# EAGLE design rev2 (EAGLE 9.3.0)
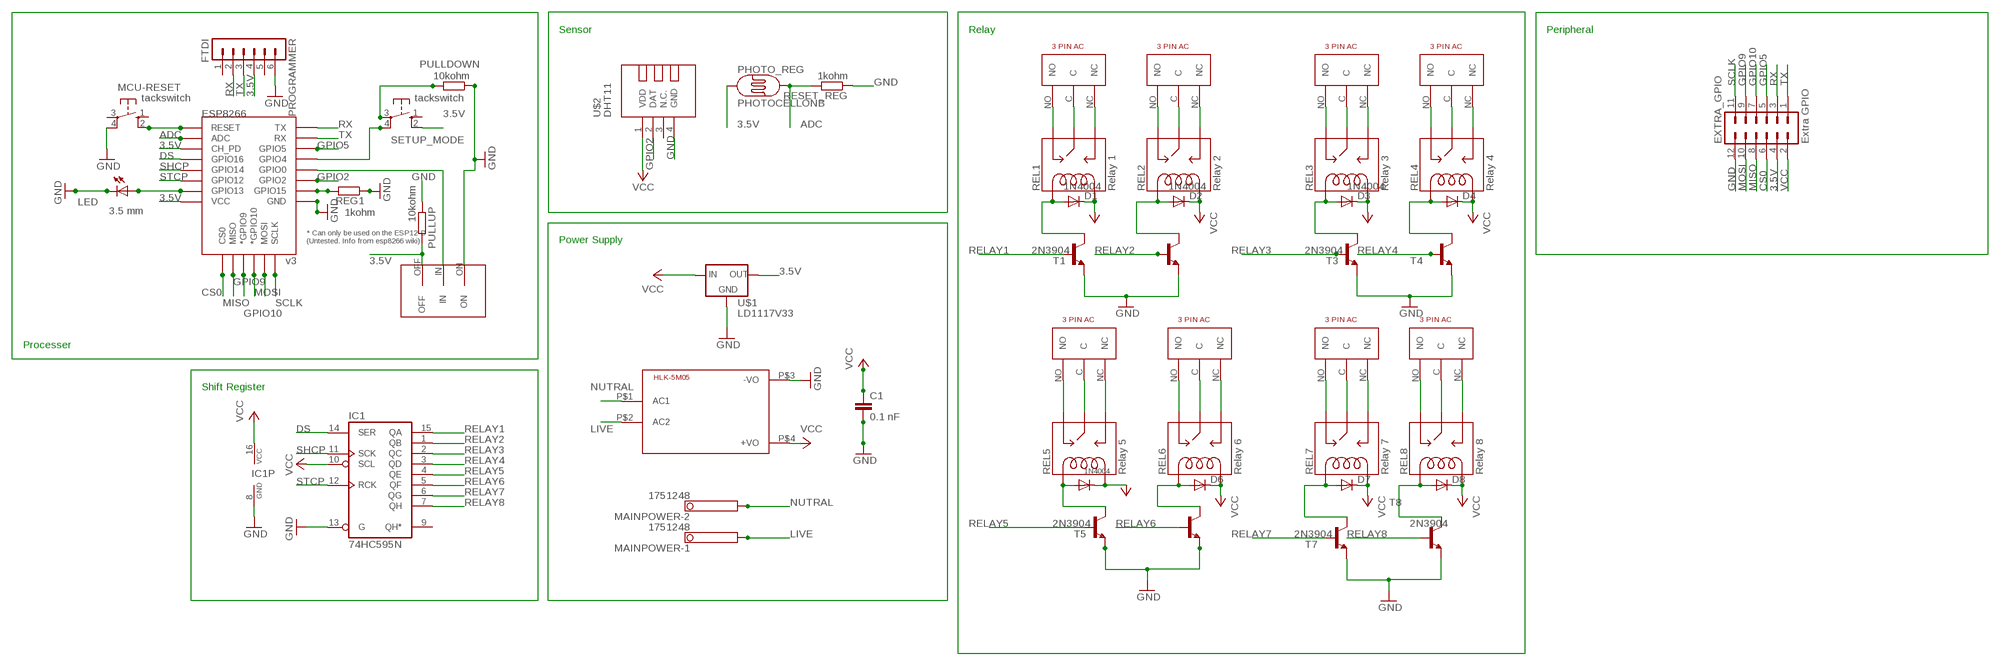
[diagram p0: schematic, sheet 1]

## Parts
C1  0.1 nF  0.1UF-KIT-EZ-50V-20%  [CAP-PTH-SMALL-KIT]
CON-REL-1  3PINAC  [LIB]
CON-REL-2  3PINAC  [LIB]
CON-REL-3  3PINAC  [LIB]
CON-REL-4  3PINAC  [LIB]
CON-REL-5  3PINAC  [LIB]
CON-REL-6  3PINAC  [LIB]
CON-REL-7  3PINAC  [LIB]
CON-REL-8  3PINAC  [LIB]
D1  1N4004  [DO41-10]
D2  1N4004  [DO41-10]
D3  1N4004  [DO41-10]
D4  1N4004  [DO41-10]
D5  1N4004  [DO41-10]
D6  1N4004  [DO41-10]
D7  1N4004  [DO41-10]
D8  1N4004  [DO41-10]
ESP8266  v3  ESP12ESMD  [ESP12E-SMD]
EXTRA_GPIO  Extra GPIO  MA06-2  [MA06-2]
FLASH  TOGGLE_SWITCH  [TOGGLE_SWITCH]
HLK-5M05  AC to DC Converter  HKLPM01  [HKLPM01]
IC1  74HC595N  [DIL16]
LED  3.5 mm  LED3MM  [LED3MM]
MAINPOWER  1751248  [1751248]
MCU-RESET  tackswitch  10-XX  [B3F-10XX]
PHOTO_REG  PHOTOCELLONB  [ON_BOARD]
PROGRAMMER  FTDI  MA06-1  [MA06-1]
PULLDOWN  10kohm  R-EU_0204/7  [0204/7]
PULLUP  10kohm  R-EU_0204/7  [0204/7]
REG1  1kohm  R-EU_0204/7  [0204/7]
REL1  Relay 1  RELAYPTH  [SRD-05VDC-SL-C]
REL2  Relay 2  RELAYPTH  [SRD-05VDC-SL-C]
REL3  Relay 3  RELAYPTH  [SRD-05VDC-SL-C]
REL4  Relay 4  RELAYPTH  [SRD-05VDC-SL-C]
REL5  Relay 5  RELAYPTH  [SRD-05VDC-SL-C]
REL6  Relay 6  RELAYPTH  [SRD-05VDC-SL-C]
REL7  Relay 7  RELAYPTH  [SRD-05VDC-SL-C]
REL8  Relay 8  RELAYPTH  [SRD-05VDC-SL-C]
RESET_REG  1kohm  R-EU_0204/7  [0204/7]
SETUP_MODE  tackswitch  10-XX  [B3F-10XX]
T1  2N3904  BC618  [TO92-EBC]
T2  2N3904  BC618  [TO92-EBC]
T3  2N3904  BC618  [TO92-EBC]
T4  2N3904  BC618  [TO92-EBC]
T5  2N3904  BC618  [TO92-EBC]
T6  2N3904  BC618  [TO92-EBC]
T7  2N3904  BC618  [TO92-EBC]
T8  2N3904  BC618  [TO92-EBC]
U$1  LD1117V33  [LD1117V33]
U$2  DHT11  TEMP-HUM-SENSOR-DHT11  [TEMP-HUM-SENSOR-DHT11]

## Nets
3.5V: ESP8266.CH_PD ESP8266.VCC EXTRA_GPIO.4 FLASH.OFF PHOTO_REG.1 PROGRAMMER.4 PULLUP.2 SETUP_MODE.2(S1) U$1.OUT
ADC: ESP8266.ADC PHOTO_REG.2 RESET_REG.2
CS0: ESP8266.CS0 EXTRA_GPIO.6
DS: ESP8266.GPIO16 IC1.14(SER)
GND: C1.2 ESP8266.GND EXTRA_GPIO.12 FLASH.ON HLK-5M05.P$3(-VO) IC1.8(GND) IC1.13(G) LED.K(C) MCU-RESET.4(P1) PROGRAMMER.6 PULLDOWN.1 PULLUP.1 REG1.1 RESET_REG.1 T1.E T2.E T3.E T4.E T5.E T6.E T7.E T8.E U$1.GND U$2.4(GND)
GPIO2: ESP8266.GPIO2 U$2.2(DAT)
GPIO5: ESP8266.GPIO5 EXTRA_GPIO.5
GPIO9: ESP8266.GPIO9(*GPIO9) EXTRA_GPIO.9
GPIO10: ESP8266.GPIO10(*GPIO10) EXTRA_GPIO.7
LIVE: HLK-5M05.P$2(AC2) MAINPOWER.1
MISO: ESP8266.MISO EXTRA_GPIO.8
MOSI: ESP8266.MOSI EXTRA_GPIO.10
N$1: D5.A REL5.COIL1 T5.C
N$2: D6.A REL6.COIL1 T6.C
N$3: D7.A REL7.COIL1 T7.C
N$4: D8.A REL8.COIL1 T8.C
N$5: D4.A REL4.COIL1 T4.C
N$6: D3.A REL3.COIL1 T3.C
N$7: ESP8266.GPIO13 LED.A
N$8: D2.A REL2.COIL1 T2.C
N$9: D1.A REL1.COIL1 T1.C
N$10: CON-REL-5.NC REL5.SWOPEN
N$11: CON-REL-5.C REL5.SWCOMMON
N$12: CON-REL-5.NO REL5.SWCLOSED(SWCLOSE)
N$13: CON-REL-6.NC REL6.SWOPEN
N$14: CON-REL-6.C REL6.SWCOMMON
N$15: CON-REL-6.NO REL6.SWCLOSED(SWCLOSE)
N$16: CON-REL-7.NC REL7.SWOPEN
N$17: CON-REL-7.C REL7.SWCOMMON
N$18: CON-REL-7.NO REL7.SWCLOSED(SWCLOSE)
N$19: CON-REL-8.NC REL8.SWOPEN
N$20: CON-REL-8.C REL8.SWCOMMON
N$21: CON-REL-8.NO REL8.SWCLOSED(SWCLOSE)
N$22: CON-REL-4.NC REL4.SWOPEN
N$23: CON-REL-4.C REL4.SWCOMMON
N$24: CON-REL-4.NO REL4.SWCLOSED(SWCLOSE)
N$25: CON-REL-3.NC REL3.SWOPEN
N$26: ESP8266.GPIO4 SETUP_MODE.4(P1)
N$27: ESP8266.GPIO15 REG1.2
N$28: ESP8266.GPIO0 FLASH.IN
N$29: PULLDOWN.2 SETUP_MODE.3(P)
N$31: ESP8266.RESET MCU-RESET.2(S1)
N$39: CON-REL-3.C REL3.SWCOMMON
N$40: CON-REL-3.NO REL3.SWCLOSED(SWCLOSE)
N$41: CON-REL-2.NC REL2.SWOPEN
N$42: CON-REL-2.C REL2.SWCOMMON
N$43: CON-REL-2.NO REL2.SWCLOSED(SWCLOSE)
N$44: CON-REL-1.NC REL1.SWOPEN
N$45: CON-REL-1.C REL1.SWCOMMON
N$46: CON-REL-1.NO REL1.SWCLOSED(SWCLOSE)
NUTRAL: HLK-5M05.P$1(AC1) MAINPOWER.2
RELAY1: IC1.15(QA) T1.B
RELAY2: IC1.1(QB) T2.B
RELAY3: IC1.2(QC) T3.B
RELAY4: IC1.3(QD) T4.B
RELAY5: IC1.4(QE) T5.B
RELAY6: IC1.5(QF) T6.B
RELAY7: IC1.6(QG) T7.B
RELAY8: IC1.7(QH) T8.B
RX: ESP8266.TXD0(TX) EXTRA_GPIO.3 PROGRAMMER.2
SCLK: ESP8266.SCLK EXTRA_GPIO.11
SHCP: ESP8266.GPIO14 IC1.11(SCK)
STCP: ESP8266.GPIO12 IC1.12(RCK)
TX: ESP8266.RXD0(RX) EXTRA_GPIO.1 PROGRAMMER.3
VCC: C1.1 D1.C D2.C D3.C D4.C D5.C D6.C D7.C D8.C EXTRA_GPIO.2 HLK-5M05.P$4(+VO) IC1.10(SCL) IC1.16(VCC) REL1.COIL0 REL2.COIL0 REL3.COIL0 REL4.COIL0 REL5.COIL0 REL6.COIL0 REL7.COIL0 REL8.COIL0 U$1.IN U$2.1(VDD)
Unconnected: IC1.9(QH*) MCU-RESET.1(S) MCU-RESET.3(P) PROGRAMMER.1 PROGRAMMER.5 SETUP_MODE.1(S) U$2.3(N.C.)

## Notes on the sheet
- Sensor | Relay | Peripheral
- Power Supply
- Processer
- Shift Register

## Library data of the parts
C1 = SparkFun-Capacitors:0.1UF: 0.1µF ceramic capacitors A capacitor is a passive two-terminal electrical component used to store electrical energy temporarily in an electric field.; PROD_ID: CAP-08370; VALUE: 0.1uF
CON-REL-1-CON-REL-8 = 3 PIN AC Connector:3PINAC
D1-D8 = adafruit:1N4004: DIODE General purpose 1N400x type rectifier (With bigger pads) http://www.ladyada.net/library/pcb/eaglelibrary.html
ESP8266 = esp8266modules:ESP12E: ESP12E Module
EXTRA_GPIO = con-lstb:MA06-2: PIN HEADER; OC_FARNELL: unknown; OC_NEWARK: unknown
FLASH = Toggle Switch:TOGGLE_SWITCH
HLK-5M05 = HLKPM01EaglesLib:HKLPM01
IC1 = 74xx:74*595: 8-bit SHIFT REGISTER, output latch
LED = led:LED: LED OSRAM: - CHIPLED LG R971, LG N971, LY N971, LG Q971, LY Q971, LO R971, LY R971 LH N974, LH R974 LS Q976, LO Q976, LY Q976 LO Q996 - Hyper CHIPLED LW Q18S LB Q993, LB Q99A, LB R99A - SideLED LS A670, LO A670, LY A670, LG A670, LP A670 LB A673, LV A673, LT A673, LW A673 LH A674 LY A675 LS A676, LA A676, LO A676, LY A676, LW A676 LS A679, LY A679, LG A679 - Hyper Micro SIDELED® LS Y876, LA Y876, LO Y876, LY Y876 LT Y87S - SmartLED LW L88C, LW L88S LB L89C, LB L89S, LG L890 LS L89K, LO L89K, LY L89K LS L896, LA L896, LO L896, LY L896 - TOPLED LS T670, LO T670, LY T670, LG T670, LP T670 LSG T670, LSP T670, LSY T670, LOP T670, LYG T670 LG T671, LOG T671, LSG T671 LB T673, LV T673, LT T673, LW T673 LH T674 LS T676, LA T676, LO T676, LY T676, LB T676, LH T676, LSB T676, LW T676 LB T67C, LV T67C, LT T67C, LS T67K, LO T67K, LY T67K, LW E67C LS E67B, LA E67B, LO E67B, LY E67B, LB E67C, LV E67C, LT E67C LW T67C LS T679, LY T679, LG T679 LS T770, LO T770, LY T770, LG T770, LP T770 LB T773, LV T773, LT T773, LW T773 LH T774 LS E675, LA E675, LY E675, LS T675 LS T776, LA T776, LO T776, LY T776, LB T776 LHGB T686 LT T68C, LB T68C - Hyper Mini TOPLED® LB M676 - Mini TOPLED Santana® LG M470 LS M47K, LO M47K, LY M47K Source: http://www.osram.convergy.de LUXEON: - LUMILED® LXK2-PW12-R00, LXK2-PW12-S00, LXK2-PW14-U00, LXK2-PW14-V00 LXK2-PM12-R00, LXK2-PM12-S00, LXK2-PM14-U00 LXK2-PE12-Q00, LXK2-PE12-R00, LXK2-PE12-S00, LXK2-PE14-T00, LXK2-PE14-U00 LXK2-PB12-K00, LXK2-PB12-L00, LXK2-PB12-M00, LXK2-PB14-N00, LXK2-PB14-P00, LXK2-PB14-Q00 LXK2-PR12-L00, LXK2-PR12-M00, LXK2-PR14-Q00, LXK2-PR14-R00 LXK2-PD12-Q00, LXK2-PD12-R00, LXK2-PD12-S00 LXK2-PH12-R00, LXK2-PH12-S00 LXK2-PL12-P00, LXK2-PL12-Q00, LXK2-PL12-R00 Source: www.luxeon.com KINGBRIGHT: KA-3528ASYC Source: www.kingbright.com
MAINPOWER = con-phoenix-350:1751248: MKDS 1/ 2-3,5 Printklemme Nennstrom: 10 A Bemessungsspannung: 160 V Raster: 3,5 mm Polzahl: 2 Montageart: Löten Anschlussart: Schraubanschluss Anschlussrichtung vom Leiter zur Platine: 0° Source: http://eshop.phoenixcontact.com .. 1751248.pdf; OC_FARNELL: unknown; OC_NEWARK: unknown
MCU-RESET SETUP_MODE = buttons:10-XX: OMRON SWITCH
PHOTO_REG = LDR:PHOTOCELL: Photo Resitor
PROGRAMMER = con-lstb:MA06-1: PIN HEADER; OC_FARNELL: unknown; OC_NEWARK: unknown
PULLDOWN PULLUP REG1 RESET_REG = resistor:R-EU_: RESISTOR, European symbol
REL1-REL8 = SRD-05VDC-SL-C:RELAY: SPDT relay (COM-00101)
T1-T8 = transistor-npn:BC618*: NPN Transistor
U$1 = LD1117V33:LD1117V33
U$2 = diy-modules:TEMP-HUM-SENSOR-DHT11: DHT11 - digital humidity & temperature sensor DHT11 datasheet available here: https://akizukidenshi.com/download/ds/aosong/DHT11.pdf Click here to find device on ebay.com <http://www.ebay.com/sch/dht11+digital+sensor>

## Net classes
0 default: width 0.2 mm, clearance 0.205 mm

## Board
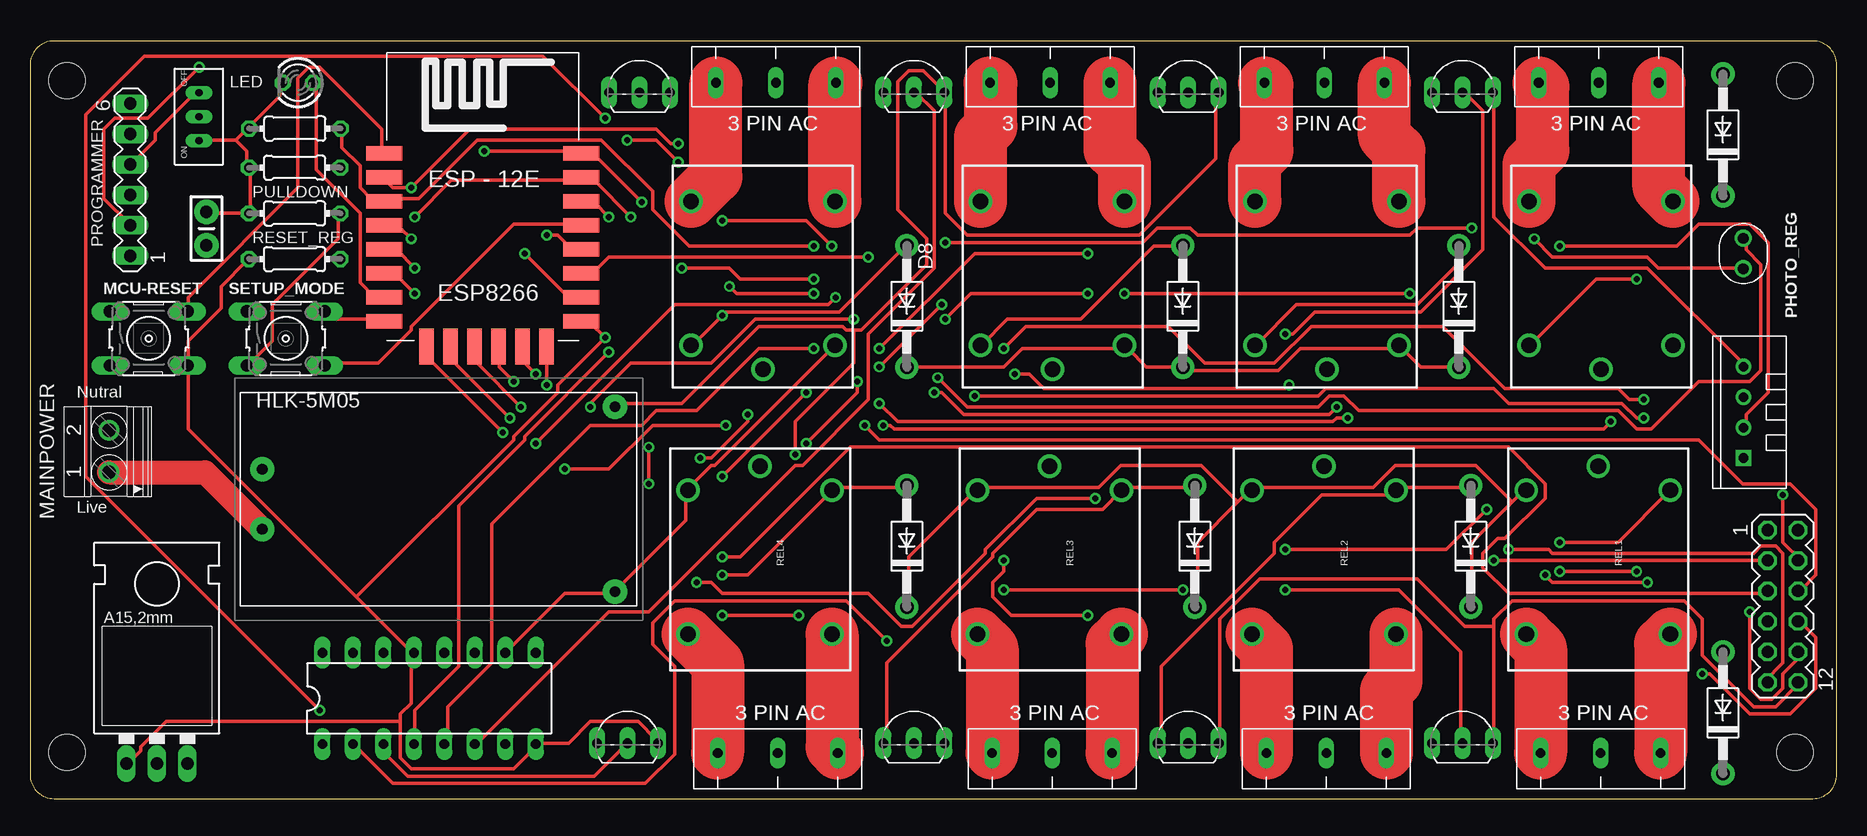
[diagram p1: board, top side]
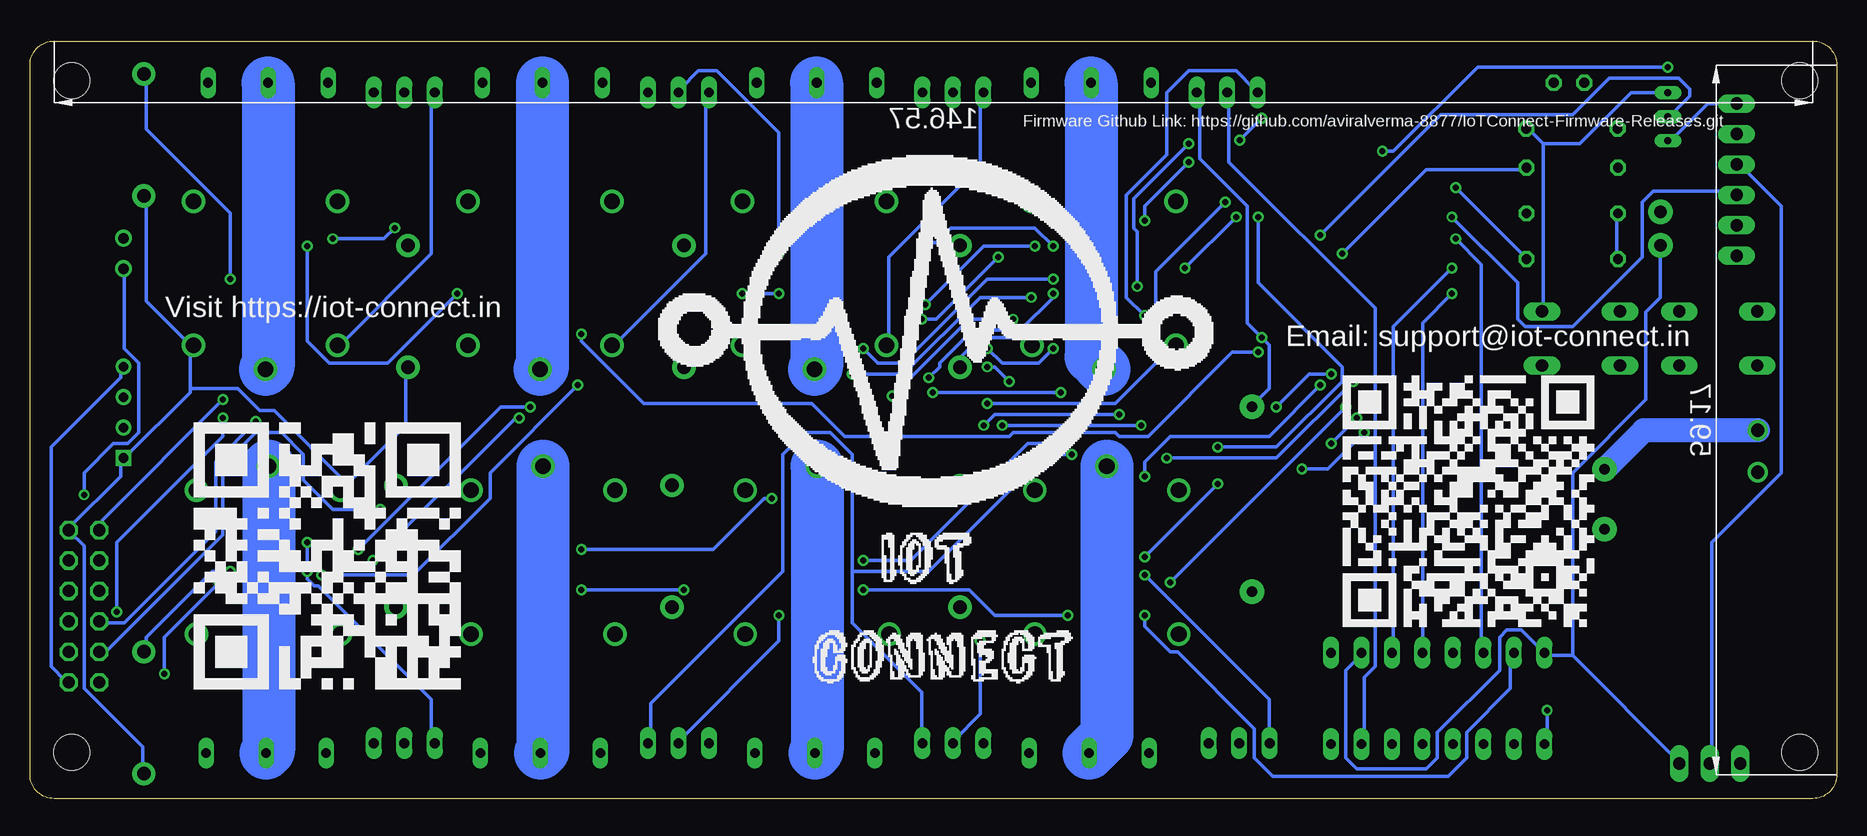
[diagram p2: board, bottom side, seen from below]

Size 150.57 x 63.17 mm. Coordinates in mm from the lower left corner, seen from the top.
Outline: 0,61.17 0,2 arc90 2,0 148.57,0 arc90 150.57,2 150.57,61.17 arc90 148.57,63.17 2,63.17 arc90 0,61.17
Copper layers (1*16): Top 0.035mm / dielectric 1.5mm / Bottom 0.035mm
Design rules "default *": minimum track width 12mil, minimum drill 0.5mm, track to track 12mil, track to pad 12mil, pad to pad 12mil, via to via 12mil, smd to smd 12mil, copper to edge 40mil, drill to drill 12mil, minimum pad ring 10mil, minimum via ring 8mil, stop-mask expansion 4mil, vias tented up to drill 0mil, thermal gap 10mil
Holes 3 mm at 3.08,59.87 147.08,59.87 147.08,3.87 3.08,3.87

### Footprints (pad centres in the part's own frame; a part is rotated, then mirrored left to right if it is on the bottom)
CAP-PTH-SMALL-KIT = drill 1.016 pad 2.032: 1 -1.397,0; 2 1.397,0
LIB = drill 0.8 long: C 5,0; NC 0,0; NO 10,0
DO41-10 = drill 1.118 pad 1.93: A 5.08,0; C -5.08,0
ESP12E-SMD = smd 3 x 1.2: ADC -8.3,3.8; CH_PD -8.3,1.8; GND 8.1,-8.2; GPIO0 8.1,-2.2; GPIO2 8.1,-4.2; GPIO4 8.1,-0.2; GPIO5 8.1,1.8; GPIO12 -8.3,-4.2; GPIO13 -8.3,-6.2; GPIO14 -8.3,-2.2; GPIO15 8.1,-6.2; GPIO16 -8.3,-0.2; RESET -8.3,5.8; RXD0 8.1,3.8; TXD0 8.1,5.8; VCC -8.3,-8.2 | smd 1.2 x 3: CS0 -4.8,-10.3; GPIO9 -0.8,-10.3; GPIO10 1.2,-10.3; MISO -2.8,-10.3; MOSI 3.2,-10.3; SCLK 5.2,-10.3
MA06-2 = drill 1.016 octagon: 1 -6.35,-1.27; 2 -6.35,1.27; 3 -3.81,-1.27; 4 -3.81,1.27; 5 -1.27,-1.27; 6 -1.27,1.27; 7 1.27,-1.27; 8 1.27,1.27; 9 3.81,-1.27; 10 3.81,1.27; 11 6.35,-1.27; 12 6.35,1.27
TOGGLE_SWITCH = drill 0.6 long: IN 2,0; OFF 4,0; ON 0,0
HKLPM01 = drill 0.889 pad 2.032: P$1 -14.7,2.5; P$2 -14.7,-2.5; P$3 14.7,7.7; P$4 14.7,-7.7
DIL16 = drill 0.813 long: 1 -8.89,-3.81; 2 -6.35,-3.81; 3 -3.81,-3.81; 4 -1.27,-3.81; 5 1.27,-3.81; 6 3.81,-3.81; 7 6.35,-3.81; 8 8.89,-3.81; 9 8.89,3.81; 10 6.35,3.81; 11 3.81,3.81; 12 1.27,3.81; 13 -1.27,3.81; 14 -3.81,3.81; 15 -6.35,3.81; 16 -8.89,3.81
LED3MM = drill 0.813 octagon: A -1.27,0; K 1.27,0
1751248 = drill 1.1 pad 1.7: 1 -1.75,-0.1; 2 1.75,-0.1
B3F-10XX = drill 1.016 long: 1 -3.251,2.261; 2 3.251,2.261; 3 -3.251,-2.261; 4 3.251,-2.261
ON_BOARD = drill 0.9: 1 -1.27,0; 2 1.27,0
MA06-1 = drill 1.016 long: 1 -6.35,0; 2 -3.81,0; 3 -1.27,0; 4 1.27,0; 5 3.81,0; 6 6.35,0
0204/7 = drill 0.813 octagon: 1 -3.81,0; 2 3.81,0
SRD-05VDC-SL-C = drill 1.3: COIL0 -5.39,-6.12; COIL1 -5.39,5.88; SWCLOSED 6.61,-6.12; SWCOMMON -7.39,-0.12; SWOPEN 6.61,5.88
TO92-EBC = drill 0.813 long: B 0,-1.27; C -2.54,-1.27; E 2.54,-1.27
LD1117V33 = drill 1.016 long: GND -2.54,-8.89; IN 2.54,-8.89; OUT 0,-8.89
TEMP-HUM-SENSOR-DHT11 = drill 0.8 square: 1 -3.81,0 | drill 0.8: 2 -1.27,0; 3 1.27,0; 4 3.81,0

### Placement (x,y rotation side)
C1  14.7,47.53 90 top
CON-REL-1  135.89,3.81 180 top
CON-REL-2  113.03,3.81 180 top
CON-REL-3  90.17,3.81 180 top
CON-REL-4  67.31,3.81 180 top
CON-REL-5  125.73,59.69 0 top
CON-REL-6  102.87,59.69 0 top
CON-REL-7  80.01,59.69 0 top
CON-REL-8  57.15,59.69 0 top
D1  141.08,7.16 90 top
D2  120.07,21.04 90 top
D3  97.07,21.04 90 top
D4  73.07,21.04 90 top
D5  141.08,55.34 90 top
D6  119.07,41.04 90 top
D7  96.07,41.04 90 top
D8  73.07,41.04 90 top
ESP8266  37.83,47.99 0 top
EXTRA_GPIO  146.07,16.04 270 top
FLASH  14.08,54.87 90 top
HLK-5M05  34.05,24.96 0 top
IC1  33.26,8.35 0 top
LED  22.32,59.69 180 top
MAINPOWER  6.49,28.96 90 top
MCU-RESET  9.89,38.37 0 top
PHOTO_REG  142.78,45.45 90 top
PROGRAMMER  8.35,51.61 90 top
PULLDOWN  22.05,48.8 0 top
PULLUP  22.08,55.87 0 top
REG1  22.05,52.61 0 top
REL1  130.81,20.32 270 top
REL2  107.95,20.32 270 top
REL3  85.09,20.32 270 top
REL4  60.96,20.32 270 top
REL5  130.81,43.18 90 top
REL6  107.95,43.18 90 top
REL7  85.09,43.18 90 top
REL8  60.96,43.18 90 top
RESET_REG  22.05,44.99 0 top
SETUP_MODE  21.32,38.37 0 top
T1  119.38,5.89 0 top
T2  96.52,5.89 0 top
T3  73.66,5.89 0 top
T4  49.8,5.89 0 top
T5  119.38,60.15 0 top
T6  96.52,60.15 0 top
T7  73.66,60.15 0 top
T8  50.8,60.15 0 top
U$1  10.58,11.81 0 top
U$2  142.78,32.21 90 top

### Tracks (layer width: path | path; a pad name or v marks a point on that pad's centre or on a via)
3.5V  (via drill 0.5)
  Top 0.305: v146.07,25.34 146.07,21.38 147.59,19.85 EXTRA_GPIO.4 | ESP8266.VCC 29.33,39.97 25.37,39.97 24.76,40.58 SETUP_MODE.2 | PULLUP.2 25.98,55.82 25.98,54.29 27.5,52.77 27.5,50.94 28.42,50.03 29.33,50.03 ESP8266.CH_PD 29.64,50.03 32.38,50.03 37.26,54.9 47.62,54.9 51.89,50.64 51.89,49.11 54.93,46.06 v65.3,46.06 | FLASH.OFF 13.79,58.87 10.43,55.51 10.43,54.9 8.6,53.07 PROGRAMMER.4 | v125.34,46.67 126.87,45.15 134.79,45.15 135.71,44.23 142.72,44.23 PHOTO_REG.1 | v120.16,47.59 115.59,47.59 114.98,46.98 97.3,46.98 96.69,47.59 93.95,47.59 92.73,46.37 v76.27,46.37
  Bottom 0.305: v146.07,25.34 146.07,27.17 143.63,29.61 142.41,29.61 141.5,30.52 141.5,36.31 142.72,37.53 142.72,43.93 PHOTO_REG.1 | 24.45,54.6 24.45,40.88 SETUP_MODE.2 | 24.45,54.6 25.67,55.82 PULLUP.2 | U$1.OUT 10.43,3.09 10.43,21.38 4.64,27.17 4.64,49.42 8.3,53.07 PROGRAMMER.4 | 24.45,54.6 21.41,54.6 17.14,58.87 14.09,58.87 FLASH.OFF | v125.34,46.67 121.08,46.67 v120.16,47.59 | v76.27,46.37 75.05,46.37 73.83,47.59 66.82,47.59 v65.3,46.06
ADC  (via drill 0.5)
  Top 0.305: ESP8266.ADC 29.64,51.55 30.25,50.94 v31.77,50.94 36.65,55.82 52.19,55.82 53.41,54.6 v54.02,54.6 | v75.66,35.09 78.1,32.65 107.36,32.65 108.27,33.57 109.49,33.57 110.71,32.35 132.35,32.35 133.88,30.82 135.1,30.82 139.06,34.79 143.33,34.79 144.24,35.7 144.24,44.54 143.02,45.76 143.02,46.67 PHOTO_REG.2 | v65.3,42.1 58.9,42.1 v58.29,42.71
  Bottom 0.305: v31.77,50.94 25.98,45.15 RESET_REG.2 | v75.66,35.09 74.75,36.01 74.75,36.31 72,39.05 68.04,39.05 65.3,41.8 v65.3,42.1 | v58.29,42.71 58.29,47.28 58.59,47.59 58.59,50.03 v54.02,54.6
CS0  (via drill 0.5)
  Top 0.305: v39.39,30.52 33.29,36.62 33.29,37.53 ESP8266.CS0 | v44.57,27.47 48.23,27.47 51.89,31.13 v57.98,31.13 | v69.56,31.13 70.78,29.91 139.06,29.91 142.72,26.25 146.68,26.25 148.81,24.12 148.81,18.63 147.59,17.41 EXTRA_GPIO.6
  Bottom 0.305: v39.39,30.52 42.44,27.47 v44.57,27.47 | v69.56,31.13 v57.98,31.13
DS  (via drill 0.5)
  Top 0.305: v31.77,46.67 30.86,47.59 29.64,47.59 ESP8266.GPIO16
  Bottom 0.305: v31.77,46.67 29.64,44.54 29.64,12.23 IC1.14
GND  (via drill 0.5)
  Top 0.305: 121.99,14.37 121.99,14.97 123.51,16.5 137.84,16.5 139.36,14.97 139.36,11.93 143.63,7.66 145.46,7.66 147.29,9.49 EXTRA_GPIO.12 | 121.99,14.37 121.99,4.92 T1.E | T5.E 121.99,58.87 121.99,48.5 126.26,44.23 134.79,44.23 142.72,36.31 U$2.4 | 121.99,14.37 119.55,14.37 115.59,18.33 102.48,18.33 99.13,14.97 99.13,4.92 T2.E | T6.E 98.82,58.87 98.82,53.38 92.42,46.98 78.1,46.98 76.27,48.81 76.27,58.87 T7.E 75.96,59.17 74.44,60.69 73.22,60.69 72.31,59.78 72.31,49.11 74.75,46.67 74.75,44.54 69.26,39.05 68.65,39.05 | ESP8266.GND 46.09,39.66 46.7,39.66 v47.92,38.44 43.96,34.48 43.96,33.87 40.3,30.21 40.3,29.91 27.2,16.8 | 68.65,39.05 68.04,39.05 67.74,39.36 60.73,39.36 54.32,32.96 48.84,32.96 HLK-5M05.P$3 | RESET_REG.1 18.05,44.84 15.92,42.71 15.92,40.88 13.18,38.14 13.18,36.31 MCU-RESET.4 13.18,36.01 13.18,30.82 27.2,16.8 | C1.2 14.7,48.81 18.05,48.81 PULLDOWN.1 18.36,48.81 18.36,52.47 REG1.1 18.05,52.77 18.05,53.99 17.14,54.9 | 17.14,54.9 14.09,54.9 FLASH.ON | 17.14,54.9 18.05,55.82 PULLUP.1 18.36,56.12 20.8,58.56 20.8,59.48 LED.K | T4.E 52.19,4.92 50.67,6.44 46.7,6.44 44.88,4.61 42.44,4.61 IC1.8 42.13,4.31 40.3,2.48 31.77,2.48 30.86,3.39 30.86,6.44 | 30.86,6.44 30.86,7.05 31.77,7.96 31.77,11.93 IC1.13 31.77,12.23 27.2,16.8 | 30.86,6.44 11.35,6.44 9.21,4.31 9.21,4 8.3,3.09 U$1.GND | v63.77,28.69 63.77,31.43 68.65,36.31 68.65,39.05
  Bottom 0.305: 82.06,18.94 82.06,28.69 83.89,30.52 86.02,30.52 87.85,28.69 87.85,18.94 98.82,7.96 98.82,4.92 T2.E | 82.06,18.94 82.06,14.67 76.27,8.88 76.27,4.92 T3.E | U$2.4 143.02,36.01 143.02,35.09 148.81,29.3 148.81,11.01 147.59,9.79 EXTRA_GPIO.12 | T8.E 53.1,58.87 53.1,53.38 49.14,49.42 49.14,39.66 v47.92,38.44 47.31,37.83 47.31,34.18 48.53,32.96 HLK-5M05.P$3 | RESET_REG.1 18.36,45.15 18.36,48.5 PULLDOWN.1 | PROGRAMMER.6 8.6,57.95 10.74,57.95 13.79,54.9 FLASH.ON | 82.06,18.94 75.66,18.94 65.91,28.69 v63.77,28.69
GPIO2  (via drill 0.5)
  Top 0.305: v127.48,46.06 137.23,46.06 139.06,47.89 143.33,47.89 144.85,46.37 144.85,33.87 143.02,32.04 143.02,31.13 U$2.2 | v91.2,42.1 v114.98,42.1 | v88.16,42.1 78.4,42.1 v76.27,39.97 | v69.87,45.15 48.23,45.15 47.01,43.93 46.09,43.93 ESP8266.GPIO2
  Bottom 0.305: v127.48,46.06 127.48,38.14 125.65,36.31 120.77,36.31 v114.98,42.1 | v88.16,42.1 v91.2,42.1 | v76.27,39.97 75.05,39.97 v69.87,45.15
GPIO5  (via drill 0.5)
  Top 0.305: v48.23,48.5 47.01,49.72 46.09,49.72 ESP8266.GPIO5 | v51.58,26.25 v51.58,29.3 | v57.68,20.16 59.2,20.16 68.34,29.3 123.21,29.3 126.26,26.25 126.26,25.03 122.9,21.68 122.29,21.68 121.08,20.46 121.08,19.24 123.21,17.11 144.54,17.11 EXTRA_GPIO.5
  Bottom 0.305: v48.23,48.5 48.23,43.02 41.22,36.01 41.22,34.79 46.7,29.3 v51.58,29.3 | v57.68,20.16 v51.58,26.25
GPIO9  (via drill 0.5)
  Top 0.305: v40.91,32.65 37.26,36.31 37.26,37.53 ESP8266.GPIO9 | v55.54,18.02 56.76,18.02 57.68,17.11 69.87,17.11 72.61,14.37 73.53,14.37 79.62,20.46 79.62,20.77 83.89,25.03 v88.77,25.03 | v104.62,20.77 118.03,20.77 v121.38,24.12
  Bottom 0.305: v55.54,18.02 v40.91,32.65 | v88.77,25.03 89.38,25.03 93.64,20.77 v104.62,20.77 | v121.38,24.12 125.34,24.12 127.78,26.56 127.78,28.69 129.61,30.52 131.74,30.52 134.49,27.78 134.49,21.99 144.54,11.93 EXTRA_GPIO.9
GPIO10  (via drill 0.5)
  Top 0.305: v40.3,34.79 39.08,36.01 39.08,37.53 ESP8266.GPIO10 | v55.85,28.39 56.76,28.39 59.81,31.43 v59.81,32.04 | v71.09,31.13 71.7,31.13 72,30.82 131.13,30.82 v131.74,31.43
  Bottom 0.305: v40.3,34.79 46.7,28.39 v55.85,28.39 | v59.81,32.04 70.17,32.04 v71.09,31.13 | v131.74,31.43 135.1,28.08 135.1,22.29 142.72,14.67 144.54,14.67 EXTRA_GPIO.7
LIVE
  Top 2: MAINPOWER.1 14.6,27.21 HLK-5M05.P$2
MISO  (via drill 0.5)
  Top 0.305: v40,31.74 35.12,36.62 35.12,37.53 ESP8266.MISO | v42.13,29.61 53.72,41.19 66.52,41.19 v67.13,41.8 | v82.06,35.4 83.28,35.4 84.5,34.18 104.62,34.18 v104.92,34.48 | v126.26,18.63 126.87,18.02 v134.79,18.02 | v139.36,10.4 139.97,10.4 143.33,7.05 146.68,7.05 148.81,9.18 148.81,13.45 147.59,14.67 EXTRA_GPIO.8
  Bottom 0.305: v42.13,29.61 v40,31.74 | v67.13,41.8 71.39,41.8 77.79,35.4 v82.06,35.4 | v104.92,34.48 112.24,27.17 112.24,25.03 118.64,18.63 v126.26,18.63 | v134.79,18.02 139.36,13.45 v139.36,10.4
MOSI  (via drill 0.5)
  Top 0.305: v42.13,35.4 41.22,36.31 41.22,37.53 ESP8266.MOSI | v46.7,32.65 46.7,32.96 50.06,36.31 56.76,36.31 60.42,39.97 v68.65,39.97 | v78.71,33.57 107.36,33.57 107.97,34.18 121.99,34.18 123.21,32.96 132.66,32.96 133.88,31.74 v134.49,31.74 | v143.33,15.58 143.33,9.18 144.24,8.27 145.16,8.27 146.07,9.18 146.07,10.4 147.59,11.93 EXTRA_GPIO.10
  Bottom 0.305: v42.13,35.4 43.96,35.4 v46.7,32.65 | v68.65,39.97 72.31,39.97 v78.71,33.57 | v134.49,31.74 134.49,30.21 143.33,21.38 v143.33,15.58
N$1  (via drill 0.5)
  Top 0.305: v133.88,43.32 130.52,43.32 125.04,37.83 REL5.COIL1
  Bottom 0.305: T5.C 117.11,58.87 117.11,45.45 124.73,37.83 REL5.COIL1 | v133.88,43.32 133.88,48.81 140.89,55.82 140.89,60.39 D5.A
N$2
  Top 0.305: D6.A 118.94,46.06 118.94,44.54 115.59,41.19 105.53,41.19 102.18,37.83 REL6.COIL1
  Bottom 0.305: T6.C 94.25,58.87 94.25,45.45 101.87,37.83 REL6.COIL1
N$3
  Top 0.305: D7.A 95.78,46.06 93.64,46.06 87.55,39.97 81.45,39.97 79.32,37.83 REL7.COIL1
  Bottom 0.305: T7.C 71.39,58.87 71.39,52.77 79.01,45.15 79.01,37.83 REL7.COIL1
N$4  (via drill 0.5)
  Top 0.305: REL8.COIL1 55.24,37.83 v57.68,40.27 57.98,40.58 67.43,40.58 72.92,46.06 D8.A
  Bottom 0.305: v57.68,40.27 59.2,41.8 59.2,50.33 55.85,53.68 55.85,58.87 54.02,60.69 50.06,60.69 48.53,59.17 T8.C
N$5  (via drill 0.5)
  Top 0.305: v57.68,18.63 59.81,18.63 66.82,25.64 REL4.COIL1 67.13,25.95 72.92,25.95 D4.A
  Bottom 0.305: v57.68,18.63 47.31,8.27 47.31,4.92 T4.C
N$6
  Top 0.305: T3.C 71.39,4.92 71.39,11.32 80.23,20.16 80.23,20.46 83.89,24.12 89.38,24.12 90.9,25.64 REL3.COIL1 91.2,25.95 97,25.95 D3.A
N$7
  Top 0.305: LED.A 23.84,59.48 23.84,52.47 27.5,48.81 27.5,43.02 28.72,41.8 29.33,41.8 ESP8266.GPIO13
N$8
  Top 0.305: T2.C 94.25,4.92 94.25,11.01 103.7,20.46 103.7,21.38 107.66,25.34 113.46,25.34 113.76,25.64 REL2.COIL1 114.06,25.95 119.86,25.95 D2.A
N$9  (via drill 0.5)
  Top 0.305: v127.48,21.38 132.35,21.38 136.62,25.64 REL1.COIL1 | v127.48,18.94 v133.88,18.94
  Bottom 0.305: v127.48,21.38 v127.48,18.94 127.48,18.33 126.87,17.72 126.56,17.72 117.11,8.27 117.11,4.92 T1.C | v133.88,18.94 135.4,18.94 140.89,13.45 140.89,12.54 D1.A
N$10
  Top 4.4: REL5.SWOPEN 124.93,52.9 126.07,54.04 126.07,59.35 CON-REL-5.NC
N$11
  Bottom 4.4: CON-REL-5.C 130.73,35.99 REL5.SWCOMMON
N$12
  Top 4.4: REL5.SWCLOSED 135.73,50.99 CON-REL-5.NO
N$13
  Top 4.4: REL6.SWOPEN 102.07,53.04 103.07,54.04 103.07,59.49 CON-REL-6.NC
N$14
  Bottom 4.4: CON-REL-6.C 107.87,35.99 REL6.SWCOMMON
N$15
  Top 4.4: REL6.SWCLOSED 114.07,54.04 112.87,55.24 CON-REL-6.NO
N$16
  Top 4.4: REL7.SWOPEN 79.21,55.18 80.07,56.04 80.07,59.63 CON-REL-7.NC
N$17
  Bottom 4.4: CON-REL-7.C 85.01,35.99 REL7.SWCOMMON
N$18
  Top 4.4: REL7.SWCLOSED 91.21,52.9 90.01,54.1 CON-REL-7.NO
N$19
  Top 4.4: REL8.SWOPEN 57.15,51.86 CON-REL-8.NC
N$20
  Bottom 4.4: CON-REL-8.C 62.15,36.86 REL8.SWCOMMON
N$21
  Top 4.4: REL8.SWCLOSED 67.08,59.62 CON-REL-8.NO
N$22
  Top 4.4: REL4.SWOPEN 66.84,4.28 CON-REL-4.NC
N$23
  Bottom 4.4: REL4.SWCOMMON 60.84,5.28 CON-REL-4.C
N$24
  Top 4.4: REL4.SWCLOSED 57.31,11.24 CON-REL-4.NO
N$25
  Top 4.4: REL3.SWOPEN 90.17,12.91 CON-REL-3.NC
N$26
  Top 0.305: ESP8266.GPIO4 45.79,47.89 40.3,47.89 31.77,39.36 31.77,39.05 29.03,36.31 24.76,36.31 SETUP_MODE.4
N$27  (via drill 0.5)
  Top 0.305: v41.22,45.45 44.88,41.8 45.79,41.8 ESP8266.GPIO15
  Bottom 0.305: v41.22,45.45 34.21,52.47 25.98,52.47 REG1.2
N$28  (via drill 0.5)
  Top 0.305: v43.05,46.98 43.96,46.98 44.88,46.06 45.79,46.06 ESP8266.GPIO0
  Bottom 0.305: v43.05,46.98 32.99,57.04 22.02,57.04 18.97,60.09 13.18,60.09 12.26,59.17 12.26,58.56 13.79,57.04 FLASH.IN
N$29
  Top 0.305: PULLDOWN.2 25.67,48.5 25.67,46.67 20.19,41.19 20.19,38.14 18.36,36.31 SETUP_MODE.3
N$31
  Top 0.305: ESP8266.RESET 29.33,53.99 29.33,55.82 24.15,61 23.23,61 22.32,60.09 22.32,50.94 13.18,41.8 13.18,40.88 MCU-RESET.2
N$39
  Bottom 4.4: REL3.SWCOMMON 84.97,4.01 CON-REL-3.C
N$40
  Top 4.4: REL3.SWCLOSED 80.17,12.51 CON-REL-3.NO
N$41
  Top 4.4: REL2.SWOPEN 113.83,9.8 113.03,9 CON-REL-2.NC
N$42
  Bottom 4.4: REL2.SWCOMMON 107.83,4.01 CON-REL-2.C
N$43
  Top 4.4: REL2.SWCLOSED 103.03,12.51 CON-REL-2.NO
N$44
  Top 4.4: REL1.SWOPEN 135.89,12.91 CON-REL-1.NC
N$45
  Bottom 4.4: REL1.SWCOMMON 130.69,4.01 CON-REL-1.C
N$46
  Top 4.4: REL1.SWCLOSED 125.89,12.51 CON-REL-1.NO
NUTRAL
  Bottom 2: MAINPOWER.2 16.1,30.71 HLK-5M05.P$1
RELAY1  (via drill 0.5)
  Top 0.305: v64.08,15.28 v57.68,15.28 | v96.08,17.41 v81.15,17.41 | v104.62,17.41 114.06,17.41 119.25,12.23 119.25,4.92 T1.B
  Bottom 0.305: v57.68,15.28 57.68,14.37 55.54,12.23 54.93,12.23 48.53,5.83 48.53,3.39 47.01,1.87 32.38,1.87 30.86,3.39 30.86,5.52 27.2,9.18 27.2,11.93 IC1.15 | v64.08,15.28 70.17,15.28 72.31,17.41 v81.15,17.41 | v104.62,17.41 v96.08,17.41
RELAY2  (via drill 0.5)
  Top 0.305: v24.15,7.35 4.64,26.86 4.64,57.04 9.52,61.91 42.74,61.91 v47.92,56.73 | v49.75,54.9 52.19,54.9 v54.02,53.07 | v57.68,48.2 64.69,48.2 v66.82,46.06 | v70.78,36.01 v75.96,41.19 | v68.95,34.79 68.95,33.87 v64.69,29.61 | v81.15,19.85 81.15,18.94 80.23,18.02 80.23,16.8 81.76,15.28 v88.16,15.28
  Bottom 0.305: v24.15,7.35 24.15,4.61 IC1.1 | v49.75,54.9 v47.92,56.73 | v54.02,53.07 57.68,49.42 v57.68,48.2 | v66.82,46.06 71.09,46.06 v75.96,41.19 | v70.78,36.01 70.17,36.01 v68.95,34.79 | v64.69,29.61 67.43,29.61 77.18,19.85 v81.15,19.85 | v88.16,15.28 88.16,13.14 96.39,4.92 T2.B
RELAY3  (via drill 0.5)
  Top 0.305: v71.39,13.14 68.04,16.5 53.72,16.5 51.89,14.67 51.89,12.84 53.72,11.01 53.72,3.7 51.28,1.26 30.25,1.26 27.2,4.31 IC1.2
  Bottom 0.305: v71.39,13.14 71.39,7.05 73.53,4.92 T3.B
RELAY4
  Top 0.305: IC1.3 29.64,4.31 29.64,3.7 31.46,1.87 47.01,1.87 49.75,4.61 T4.B
RELAY5  (via drill 0.5)
  Top 0.305: v48.23,37.23 41.22,30.21 41.22,29.91 35.73,24.42 35.73,11.01 32.07,7.35 32.07,4.61 IC1.4 | v104.62,38.75 105.23,38.75 107.05,40.58 115.89,40.58 121.08,45.76 121.08,57.34 119.55,58.87 T5.B
  Bottom 0.305: v48.23,37.23 50.36,37.23 57.37,30.21 59.81,30.21 60.12,30.52 68.65,30.52 68.95,30.21 82.67,30.21 85.41,32.96 99.43,32.96 104.62,38.14 v104.62,38.75
RELAY6  (via drill 0.5)
  Top 0.305: v65.3,37.53 60.73,37.53 55.54,32.35 52.19,32.35 50.97,31.13 46.7,31.13 38.48,22.9 38.48,11.32 34.82,7.66 34.82,4.61 IC1.5 | v70.78,37.53 78.71,45.45 v88.16,45.45
  Bottom 0.305: v65.3,37.53 66.52,36.31 69.56,36.31 v70.78,37.53 | v88.16,45.45 88.16,55.51 93.34,60.69 94.86,60.69 96.39,59.17 T6.B
RELAY7
  Top 0.305: IC1.6 37.26,4.61 48.23,15.58 51.58,15.58 63.77,27.78 64.38,27.78 69.87,33.26 69.87,38.75 75.36,44.23 75.36,57.34 73.83,58.87 T7.B
RELAY8
  Bottom 0.305: IC1.7 39.39,4.61 39.39,10.1 38.48,11.01 38.48,40.88 50.67,53.07 50.67,58.87 T8.B
RX  (via drill 0.5)
  Top 0.305: v37.87,53.99 45.79,53.99 ESP8266.TXD0 46.09,53.68 47.01,53.68 v50.97,49.72 | v14.09,61 9.82,56.73 7.08,56.73 6.17,55.82 6.17,50.03 8.3,47.89 PROGRAMMER.2 | v121.99,19.85 144.54,19.85 EXTRA_GPIO.3 | v109.8,31.74 108.88,31.74 108.58,31.43 72.31,31.43 v70.78,32.96
  Bottom 0.305: v37.87,53.99 36.95,53.99 29.94,61 v14.09,61 | v121.99,19.85 110.1,31.74 v109.8,31.74 | v70.78,32.96 60.12,32.96 56.76,36.31 56.76,43.93 v50.97,49.72
SCLK  (via drill 0.5)
  Top 0.305: v43.05,34.48 43.05,37.53 ESP8266.SCLK | v64.69,33.87 v57.68,26.86 | v75.36,33.87 75.96,33.87 77.79,32.04 108.27,32.04 v108.88,32.65 | v123.21,20.77 126.56,20.77 126.87,20.46 143.63,20.46 144.24,21.07 145.46,21.07 146.07,20.46 146.07,11.32 144.54,9.79 EXTRA_GPIO.11
  Bottom 0.305: v43.05,34.48 47.31,30.21 55.54,30.21 57.68,28.08 v57.68,26.86 | v75.36,33.87 v64.69,33.87 | v108.88,32.65 111.32,32.65 v123.21,20.77
SHCP  (via drill 0.5)
  Top 0.305: v32.07,44.23 30.55,45.76 29.64,45.76 ESP8266.GPIO14
  Bottom 0.305: v32.07,44.23 36.95,39.36 36.95,12.23 IC1.11
STCP  (via drill 0.5)
  Top 0.305: v32.07,42.1 30.55,43.62 29.64,43.62 ESP8266.GPIO12
  Bottom 0.305: v32.07,42.1 34.51,39.66 34.51,12.23 IC1.12
TX  (via drill 0.5)
  Top 0.305: v32.07,48.5 35.12,51.55 45.79,51.55 ESP8266.RXD0 46.09,51.55 47.01,51.55 v50.06,48.5 | v134.49,33.26 133.27,33.26 132.35,34.18 122.9,34.18 117.72,39.36 106.75,39.36 103.7,36.31 97.91,36.31 94.86,39.36 82.98,39.36 v81.15,37.53 | v65.3,43.32 59.2,43.32 58.29,44.23 v54.32,44.23
  Bottom 0.305: v32.07,48.5 26.59,43.02 26.59,39.97 25.98,39.36 22.02,39.36 16.22,45.15 16.22,49.72 15.31,50.64 8.6,50.64 PROGRAMMER.3 | v134.49,33.26 144.54,23.2 144.54,22.59 EXTRA_GPIO.1 | v81.15,37.53 79.93,36.31 77.79,36.31 70.78,43.32 v65.3,43.32 | v50.06,48.5 v54.32,44.23
VCC
  Top 0.305: D4.C 73.22,16.19 73.22,20.16 78.71,25.64 REL3.COIL0 79.01,25.95 89.07,25.95 90.9,27.78 97.61,27.78 100.65,24.73 | 100.65,24.73 101.57,25.64 REL2.COIL0 101.87,25.95 111.93,25.95 113.76,27.78 120.47,27.78 123.51,24.73 | 100.65,24.73 97.3,21.38 97.3,16.19 D3.C | D6.C 118.94,36.01 115.89,36.01 114.37,37.53 REL6.COIL0 114.06,37.53 105.84,37.53 104.01,35.7 96.08,35.7 D7.C 95.78,36.01 93.03,36.01 91.51,37.53 REL7.COIL0 91.2,37.53 82.67,37.53 81.15,36.01 73.22,36.01 D8.C | 123.51,24.73 124.43,25.64 REL1.COIL0 | 123.51,24.73 120.16,21.38 120.16,16.19 D2.C | IC1.10 39.69,12.23 44.57,17.11 48.53,17.11 HLK-5M05.P$4 48.84,17.41 54.63,23.2 54.63,25.64 REL4.COIL0 54.93,25.95 56.76,27.78 57.07,27.78 66.82,37.53 REL8.COIL0
  Bottom 0.305: D5.C 140.89,50.03 140.89,41.49 137.23,37.83 REL5.COIL0 137.23,37.53 137.23,34.18 | D1.C 141.19,2.17 141.19,4.31 146.07,9.18 146.07,21.07 147.29,22.29 EXTRA_GPIO.2 147.29,22.59 143.02,26.86 143.02,28.39 U$2.1 142.72,28.39 137.23,33.87 137.23,34.18 | 124.12,26.25 124.43,25.95 REL1.COIL0 124.12,26.25 | 124.12,26.25 119.25,31.13 119.25,35.7 D6.C | 137.23,34.18 133.27,34.18 131.44,32.35 130.22,32.35 124.12,26.25 | 22.02,11.93 24.15,11.93 IC1.16 24.45,12.23 26.28,14.06 27.5,14.06 28.11,13.45 28.11,10.71 33.29,5.52 33.29,3.39 34.21,2.48 40,2.48 40.91,3.39 40.91,10.71 39.69,11.93 IC1.10 | 22.02,11.93 13.18,3.09 U$1.IN | 22.02,11.93 22.02,27.17 15.92,33.26 15.92,40.58 14.7,41.8 14.7,46.06 C1.1 | D8.C 72.92,36.01 72.92,36.92 71.39,38.44 67.74,38.44 67.13,37.83 REL8.COIL0

### Text on the board
tNames: Nutral | Live
bNames: Firmware Github Link: https://github.com/aviralverma-8877/IoTConnect-Firmware-Releases.git | Visit https://iot-connect.in | Email: support@iot-connect.in